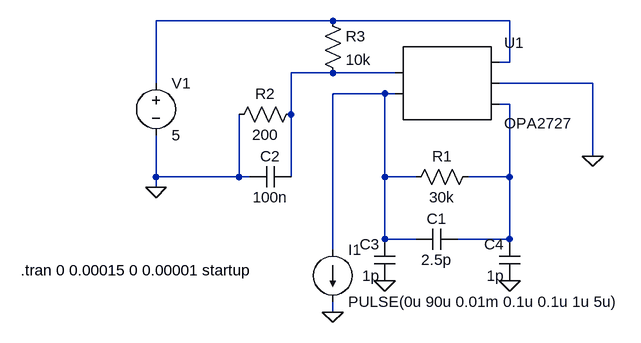
[diagram p0: schematic Draft1.asc]
Draft1.asc, the LTspice schematic file:
Version 4
SHEET 1 880 788
WIRE 32 288 -240 288
WIRE 304 288 32 288
WIRE 304 352 304 288
WIRE 304 352 288 352
WIRE 32 368 -32 368
WIRE 128 368 32 368
WIRE -240 384 -240 288
WIRE 432 384 288 384
WIRE 112 400 32 400
WIRE 128 400 112 400
WIRE 304 416 288 416
WIRE -32 432 -32 368
WIRE 432 496 432 384
WIRE -240 528 -240 464
WIRE -112 528 -112 432
WIRE -112 528 -240 528
WIRE -96 528 -112 528
WIRE -32 528 -32 432
WIRE 112 528 112 400
WIRE 160 528 112 528
WIRE 304 528 304 416
WIRE 304 528 240 528
WIRE -240 544 -240 528
WIRE 112 624 112 528
WIRE 160 624 112 624
WIRE 304 624 304 528
WIRE 304 624 224 624
WIRE 32 640 32 400
WIRE 32 736 32 720
FLAG 32 736 0
FLAG -240 544 0
FLAG 432 496 0
FLAG 112 688 0
FLAG 304 688 0
SYMBOL current 32 640 R0
WINDOW 123 0 0 Left 0
WINDOW 39 0 0 Left 0
SYMATTR InstName I1
SYMATTR Value PULSE(0u 90u 0.01m 0.1u 0.1u 1u 5u)
SYMBOL res 256 512 R90
WINDOW 0 0 56 VBottom 2
WINDOW 3 32 56 VTop 2
SYMATTR InstName R1
SYMATTR Value 30k
SYMBOL cap 224 608 R90
WINDOW 0 0 32 VBottom 2
WINDOW 3 32 32 VTop 2
SYMATTR InstName C1
SYMATTR Value 2.5p
SYMBOL voltage -240 368 R0
WINDOW 123 0 0 Left 0
WINDOW 39 0 0 Left 0
SYMATTR InstName V1
SYMATTR Value 5
SYMBOL res -16 416 R90
WINDOW 0 0 56 VBottom 2
WINDOW 3 32 56 VTop 2
SYMATTR InstName R2
SYMATTR Value 200
SYMBOL cap -32 512 R90
WINDOW 0 0 32 VBottom 2
WINDOW 3 32 32 VTop 2
SYMATTR InstName C2
SYMATTR Value 100n
SYMBOL res 16 272 R0
SYMATTR InstName R3
SYMATTR Value 10k
SYMBOL AutoGenerated\\OPA2727 208 384 R0
SYMATTR InstName U1
SYMBOL cap 128 688 R180
WINDOW 0 24 56 Left 2
WINDOW 3 24 8 Left 2
SYMATTR InstName C3
SYMATTR Value 1p
SYMBOL cap 320 688 R180
WINDOW 0 24 56 Left 2
WINDOW 3 24 8 Left 2
SYMATTR InstName C4
SYMATTR Value 1p
TEXT -448 672 Left 2 !.tran 0 0.00015 0 0.00001 startup

The netlist it stands for:
* Draft1.asc
I1 N003 0 PULSE(0u 90u 0.01m 0.1u 0.1u 1u 5u)
R1 N004 N003 30k
C1 N004 N003 2.5p
V1 N001 0 5
R2 N002 0 200
C2 N002 0 100n
R3 N001 N002 10k
* U1: OPA2727 (symbol AutoGenerated\OPA2727 not available, pins judged from their places): pin1=N002 pin2=N003 pin3=N001 pin4=0 pin5=N004
C3 0 N003 1p
C4 0 N004 1p
.tran 0 0.00015 0 0.00001 startup
.backanno
.end